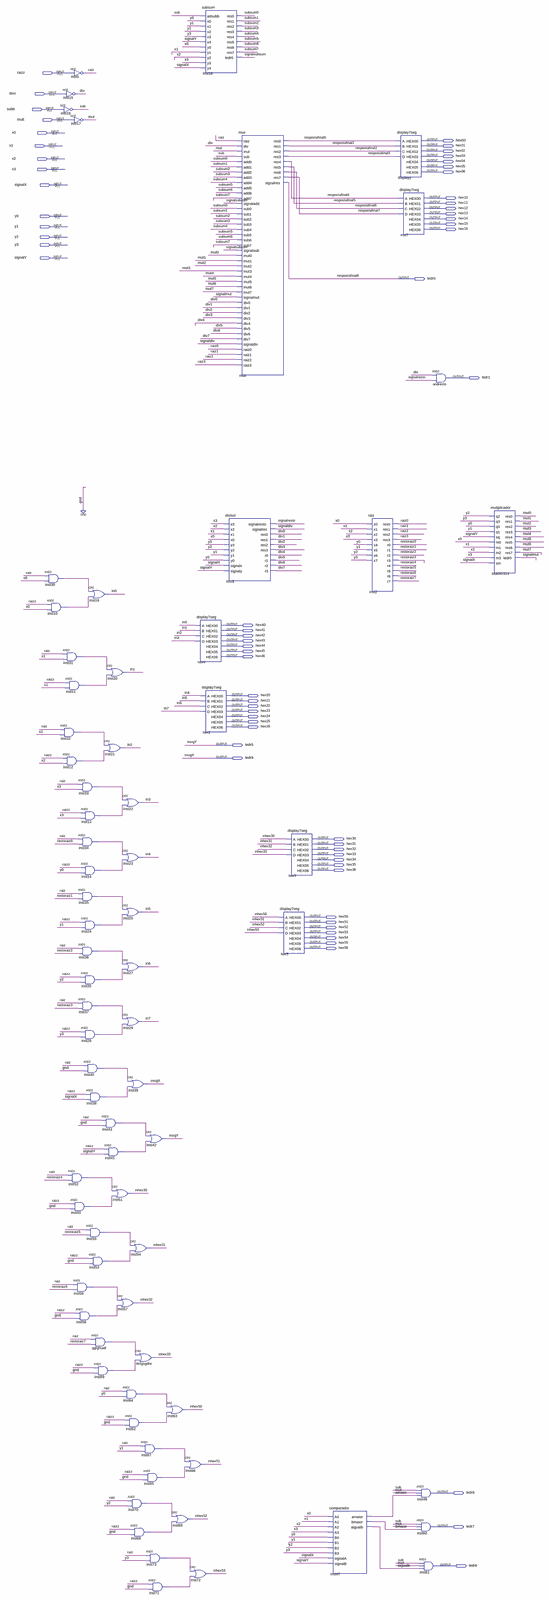
[diagram p0: schematic sheet, whole]
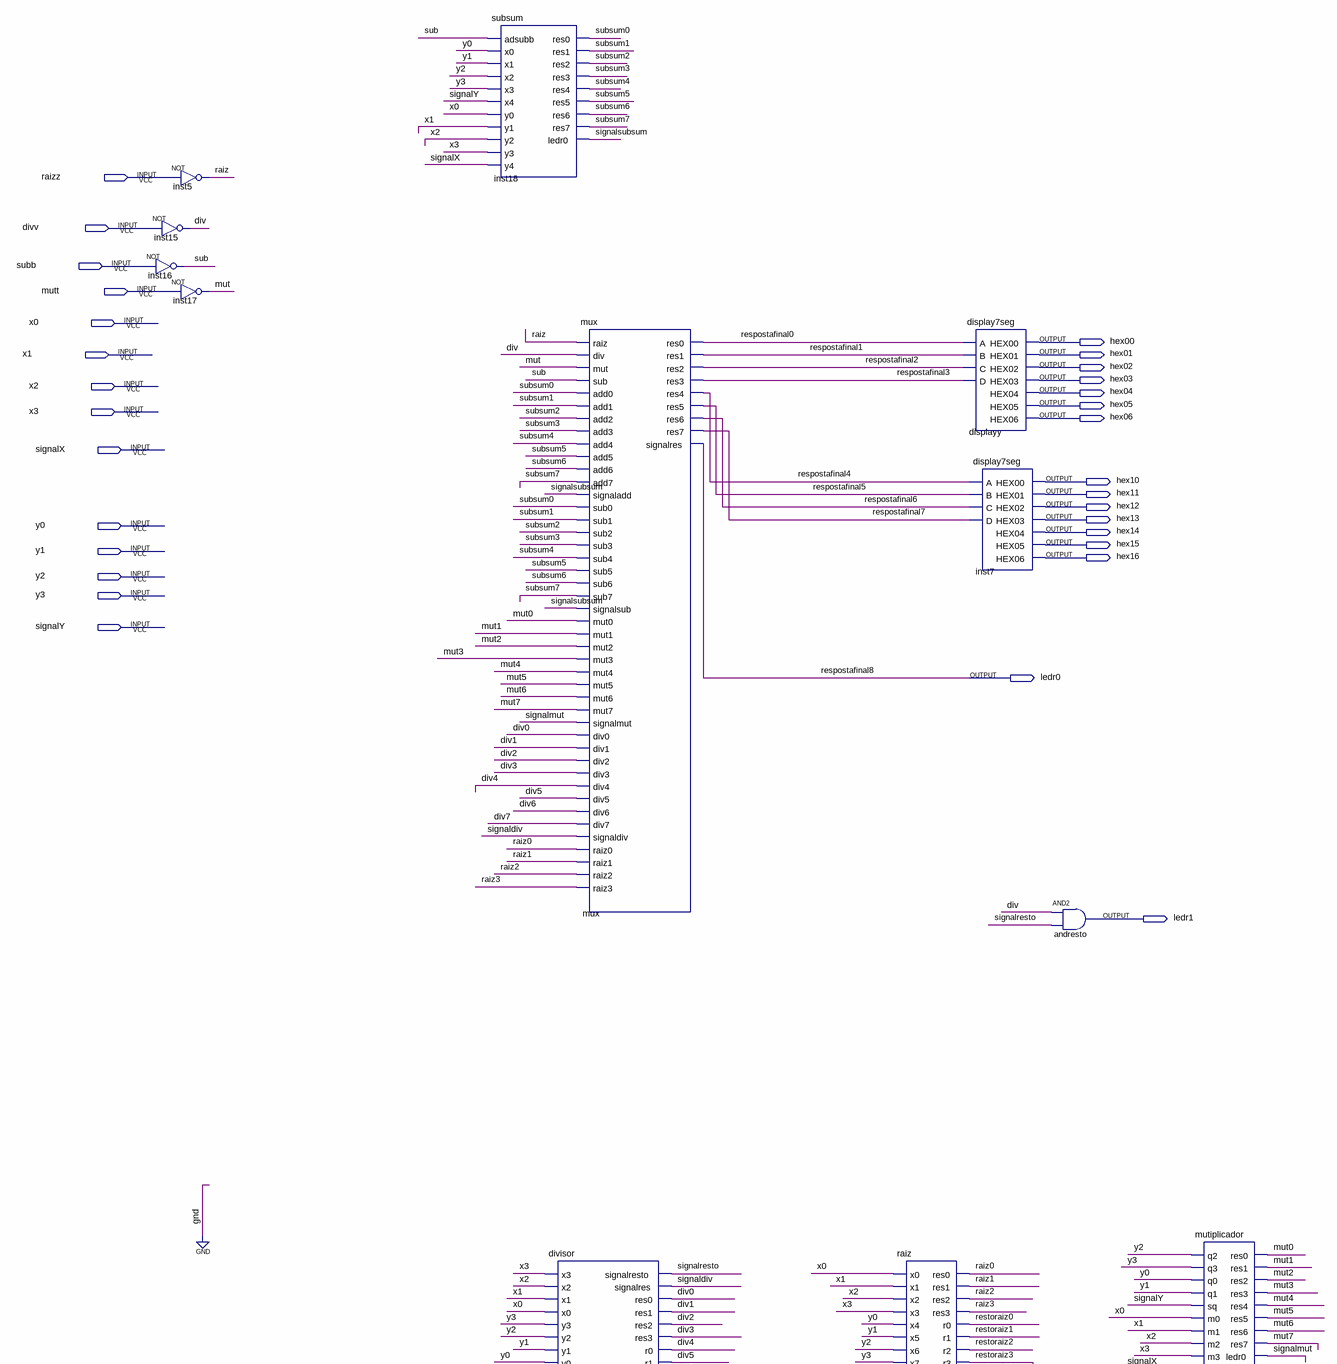
[diagram p1: schematic sheet, upper part]
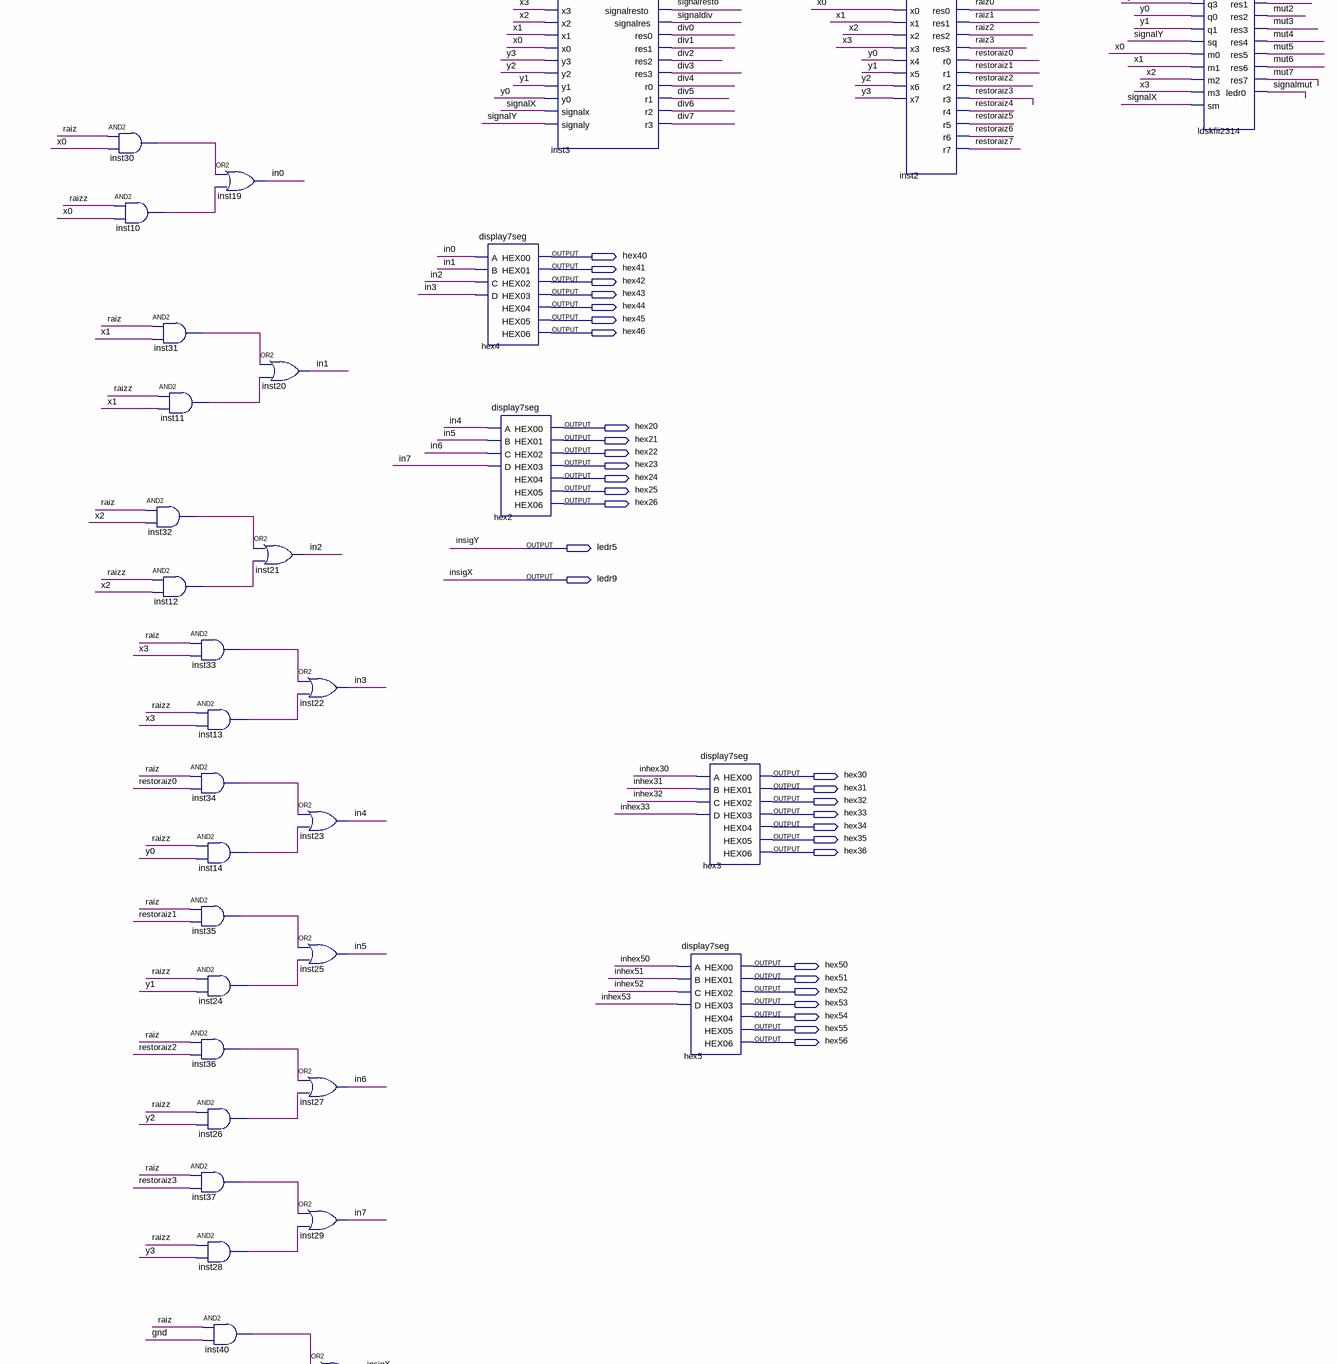
[diagram p2: schematic sheet, middle part]
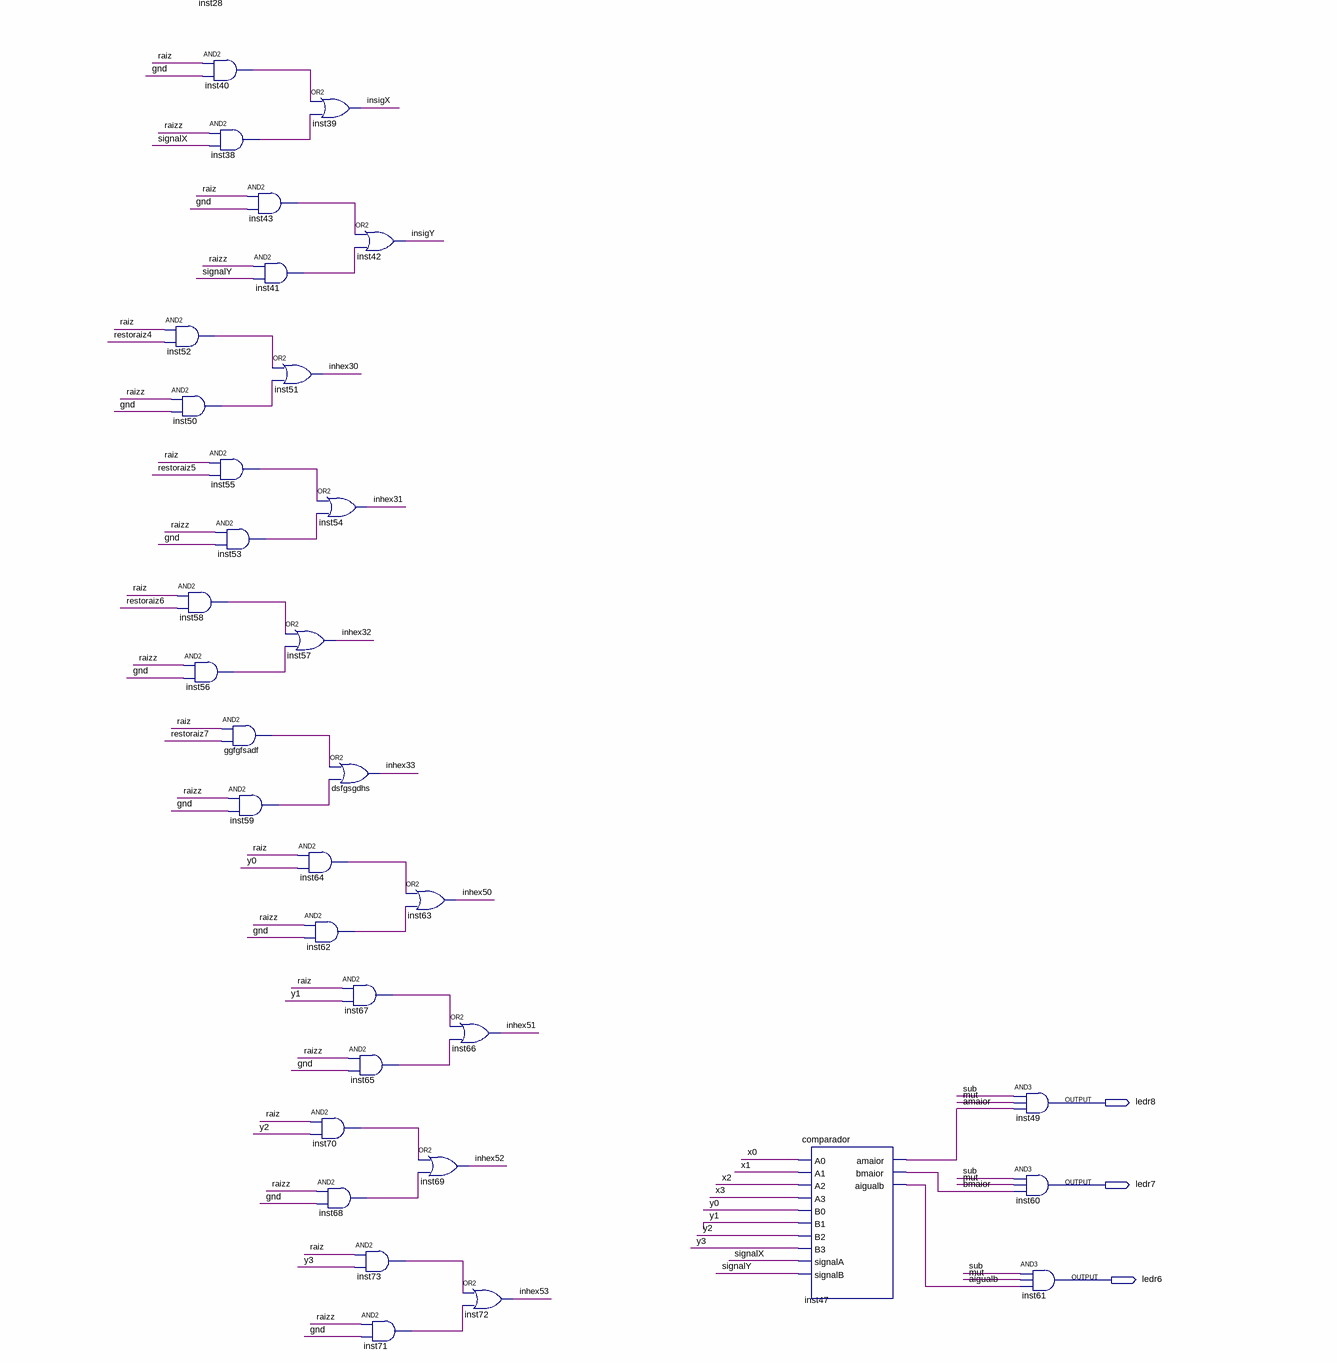
[diagram p3: schematic sheet, lower part]
// Quartus schematic Calculadora.bdf as structural Verilog: 74 symbols, 63 pins
module Calculadora (
  input  raizz,
  input  divv,
  input  subb,
  input  mutt,
  input  x0,
  input  x1,
  input  x2,
  input  x3,
  input  signalX,
  input  y0,
  input  y1,
  input  y2,
  input  y3,
  input  signalY,
  output hex00,
  output hex01,
  output hex02,
  output hex03,
  output hex04,
  output hex05,
  output hex06,
  output hex10,
  output hex11,
  output hex12,
  output hex13,
  output hex14,
  output hex15,
  output hex16,
  output ledr0,
  output ledr1,
  output hex40,
  output hex41,
  output hex42,
  output hex43,
  output hex44,
  output hex45,
  output hex46,
  output hex20,
  output hex21,
  output hex22,
  output hex23,
  output hex24,
  output hex25,
  output hex26,
  output ledr5,
  output ledr9,
  output hex30,
  output hex31,
  output hex32,
  output hex33,
  output hex34,
  output hex35,
  output hex36,
  output hex50,
  output hex51,
  output hex52,
  output hex53,
  output hex54,
  output hex55,
  output hex56,
  output ledr8,
  output ledr7,
  output ledr6
);

  wire aigualb, amaior, bmaior, div, div0, div1, div2, div3, div4, div5, div6, div7, ggfgfsadf_out, in0, in1,
       in2, in3, in4, in5, in6, in7, inhex30, inhex31, inhex32, inhex33, inhex50, inhex51, inhex52, inhex53,
       inst10_out, inst11_out, inst12_out, inst13_out, inst14_out, inst24_out, inst26_out, inst28_out,
       inst30_out, inst31_out, inst32_out, inst33_out, inst34_out, inst35_out, inst36_out, inst37_out,
       inst38_out, inst40_out, inst41_out, inst43_out, inst50_out, inst52_out, inst53_out, inst55_out,
       inst56_out, inst58_out, inst59_out, inst62_out, inst64_out, inst65_out, inst67_out, inst68_out,
       inst70_out, inst71_out, inst73_out, mut, mut0, mut1, mut2, mut3, mut4, mut5, mut6, mut7, raiz, raiz0,
       raiz1, raiz2, raiz3, respostafinal0, respostafinal1, respostafinal2, respostafinal3, respostafinal4,
       respostafinal5, respostafinal6, respostafinal7, restoraiz0, restoraiz1, restoraiz2, restoraiz3,
       restoraiz4, restoraiz5, restoraiz6, restoraiz7, signaldiv, signalmut, signalresto, signalsubsum, sub,
       subsum0, subsum1, subsum2, subsum3, subsum4, subsum5, subsum6, subsum7;

  and inst30 (inst30_out, raiz, x0);
  not inst15 (div, divv);
  not inst16 (sub, subb);
  and inst10 (inst10_out, raizz, x0);
  and inst31 (inst31_out, raiz, x1);
  and inst11 (inst11_out, raizz, x1);
  and inst32 (inst32_out, raiz, x2);
  and inst12 (inst12_out, raizz, x2);
  not inst5 (raiz, raizz);
  not inst17 (mut, mutt);
  and inst33 (inst33_out, raiz, x3);
  and inst13 (inst13_out, raizz, x3);
  and inst34 (inst34_out, raiz, restoraiz0);
  and inst14 (inst14_out, raizz, y0);
  and inst35 (inst35_out, raiz, restoraiz1);
  and inst24 (inst24_out, raizz, y1);
  and inst36 (inst36_out, raiz, restoraiz2);
  and inst26 (inst26_out, raizz, y2);
  and inst37 (inst37_out, raiz, restoraiz3);
  and inst28 (inst28_out, raizz, y3);
  and inst40 (inst40_out, raiz, 1'b0);
  and inst38 (inst38_out, raizz, signalX);
  and inst52 (inst52_out, raiz, restoraiz4);
  and inst50 (inst50_out, raizz, 1'b0);
  and inst55 (inst55_out, raiz, restoraiz5);
  and inst58 (inst58_out, raiz, restoraiz6);
  and inst56 (inst56_out, raizz, 1'b0);
  or inst19 (in0, inst30_out, inst10_out);
  or inst20 (in1, inst31_out, inst11_out);
  or inst21 (in2, inst32_out, inst12_out);
  and inst43 (inst43_out, raiz, 1'b0);
  and inst41 (inst41_out, raizz, signalY);
  and inst53 (inst53_out, raizz, 1'b0);
  and ggfgfsadf (ggfgfsadf_out, raiz, restoraiz7);
  and inst59 (inst59_out, raizz, 1'b0);
  or inst22 (in3, inst33_out, inst13_out);
  or inst23 (in4, inst34_out, inst14_out);
  or inst25 (in5, inst35_out, inst24_out);
  or inst27 (in6, inst36_out, inst26_out);
  or inst29 (in7, inst37_out, inst28_out);
  or inst39 (ledr9, inst40_out, inst38_out);
  or inst51 (inhex30, inst52_out, inst50_out);
  or inst57 (inhex32, inst58_out, inst56_out);
  and inst64 (inst64_out, raiz, y0);
  and inst62 (inst62_out, raizz, 1'b0);
  and inst70 (inst70_out, raiz, y2);
  or inst42 (ledr5, inst43_out, inst41_out);
  or inst54 (inhex31, inst55_out, inst53_out);
  or dsfgsgdhs (inhex33, ggfgfsadf_out, inst59_out);
  and inst67 (inst67_out, raiz, y1);
  and inst65 (inst65_out, raizz, 1'b0);
  and inst68 (inst68_out, raizz, 1'b0);
  and inst73 (inst73_out, raiz, y3);
  and inst71 (inst71_out, raizz, 1'b0);
  or inst63 (inhex50, inst64_out, inst62_out);
  or inst66 (inhex51, inst67_out, inst65_out);
  or inst69 (inhex52, inst70_out, inst68_out);
  or inst72 (inhex53, inst73_out, inst71_out);
  subsum inst18 (
    .adsubb(sub), .x0(y0), .x1(y1), .x2(y2), .x3(y3), .x4(signalY), .y0(x0), .y1(x1), .y2(x2), .y3(x3),
    .y4(signalX), .res0(subsum0), .res1(subsum1), .res2(subsum2), .res3(subsum3), .res4(subsum4),
    .res5(subsum5), .res6(subsum6), .res7(subsum7), .ledr0(signalsubsum));
  display7seg hex4 (
    .A(in0), .B(in1), .C(in2), .D(in3), .HEX00(hex40), .HEX01(hex41), .HEX02(hex42), .HEX03(hex43),
    .HEX04(hex44), .HEX05(hex45), .HEX06(hex46));
  display7seg hex2 (
    .A(in4), .B(in5), .C(in6), .D(in7), .HEX00(hex20), .HEX01(hex21), .HEX02(hex22), .HEX03(hex23),
    .HEX04(hex24), .HEX05(hex25), .HEX06(hex26));
  divisor inst3 (
    .x3(x3), .x2(x2), .x1(x1), .x0(x0), .y3(y3), .y2(y2), .y1(y1), .y0(y0), .signalx(signalX),
    .signaly(signalY), .signalresto(signalresto), .signalres(signaldiv), .res0(div0), .res1(div1),
    .res2(div2), .res3(div3), .r0(div4), .r1(div5), .r2(div6), .r3(div7));
  mux mux (
    .raiz(raiz), .div(div), .mut(mut), .sub(sub), .add0(subsum0), .add1(subsum1), .add2(subsum2),
    .add3(subsum3), .add4(subsum4), .add5(subsum5), .add6(subsum6), .add7(subsum7), .signaladd(signalsubsum),
    .sub0(subsum0), .sub1(subsum1), .sub2(subsum2), .sub3(subsum3), .sub4(subsum4), .sub5(subsum5),
    .sub6(subsum6), .sub7(subsum7), .signalsub(signalsubsum), .mut0(mut0), .mut1(mut1), .mut2(mut2),
    .mut3(mut3), .mut4(mut4), .mut5(mut5), .mut6(mut6), .mut7(mut7), .signalmut(signalmut), .div0(div0),
    .div1(div1), .div2(div2), .div3(div3), .div4(div4), .div5(div5), .div6(div6), .div7(div7),
    .signaldiv(signaldiv), .raiz0(raiz0), .raiz1(raiz1), .raiz2(raiz2), .raiz3(raiz3), .res0(respostafinal0),
    .res1(respostafinal1), .res2(respostafinal2), .res3(respostafinal3), .res4(respostafinal4),
    .res5(respostafinal5), .res6(respostafinal6), .res7(respostafinal7), .signalres(ledr0));
  display7seg hex3 (
    .A(inhex30), .B(inhex31), .C(inhex32), .D(inhex33), .HEX00(hex30), .HEX01(hex31), .HEX02(hex32),
    .HEX03(hex33), .HEX04(hex34), .HEX05(hex35), .HEX06(hex36));
  display7seg hex5 (
    .A(inhex50), .B(inhex51), .C(inhex52), .D(inhex53), .HEX00(hex50), .HEX01(hex51), .HEX02(hex52),
    .HEX03(hex53), .HEX04(hex54), .HEX05(hex55), .HEX06(hex56));
  comparador inst47 (
    .A0(x0), .A1(x1), .A2(x2), .A3(x3), .B0(y0), .B1(y1), .B2(y2), .B3(y3), .signalA(signalX),
    .signalB(signalY), .amaior(amaior), .bmaior(bmaior), .aigualb(aigualb));
  raiz inst2 (
    .x0(x0), .x1(x1), .x2(x2), .x3(x3), .x4(y0), .x5(y1), .x6(y2), .x7(y3), .res0(raiz0), .res1(raiz1),
    .res2(raiz2), .res3(raiz3), .r0(restoraiz0), .r1(restoraiz1), .r2(restoraiz2), .r3(restoraiz3),
    .r4(restoraiz4), .r5(restoraiz5), .r6(restoraiz6), .r7(restoraiz7));
  display7seg displayy (
    .A(respostafinal0), .B(respostafinal1), .C(respostafinal2), .D(respostafinal3), .HEX00(hex00),
    .HEX01(hex01), .HEX02(hex02), .HEX03(hex03), .HEX04(hex04), .HEX05(hex05), .HEX06(hex06));
  display7seg inst7 (
    .A(respostafinal4), .B(respostafinal5), .C(respostafinal6), .D(respostafinal7), .HEX00(hex10),
    .HEX01(hex11), .HEX02(hex12), .HEX03(hex13), .HEX04(hex14), .HEX05(hex15), .HEX06(hex16));
  and inst49 (ledr8, sub, mut, amaior);
  and inst60 (ledr7, sub, mut, bmaior);
  and inst61 (ledr6, sub, mut, aigualb);
  and andresto (ledr1, div, signalresto);
  mutiplicador ldskfii2314 (
    .q2(y2), .q3(y3), .q0(y0), .q1(y1), .sq(signalY), .m0(x0), .m1(x1), .m2(x2), .m3(x3), .sm(signalX),
    .res0(mut0), .res1(mut1), .res2(mut2), .res3(mut3), .res4(mut4), .res5(mut5), .res6(mut6), .res7(mut7),
    .ledr0(signalmut));

  // Other names for the same wires on the sheet: insigX = ledr9; insigY = ledr5; respostafinal8 = ledr0
endmodule
